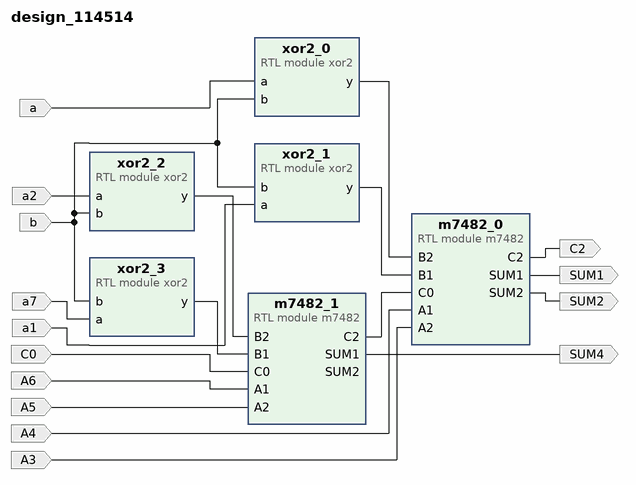
[diagram p0: block diagram of the top level]
# Vivado block design design_114514, xc7z020clg400-1, Vivado 2024.2
create_bd_design design_114514

create_bd_port -dir I A3
create_bd_port -dir I A4
create_bd_port -dir I A5
create_bd_port -dir I A6
create_bd_port -dir I C0
create_bd_port -dir O C2
create_bd_port -dir O SUM1
create_bd_port -dir O SUM2
create_bd_port -dir O SUM4
create_bd_port -dir I a
create_bd_port -dir I a1
create_bd_port -dir I a2
create_bd_port -dir I a7
create_bd_port -dir I b

create_bd_cell -type module -reference m7482 m7482_0
create_bd_cell -type module -reference m7482 m7482_1
create_bd_cell -type module -reference xor2 xor2_0
create_bd_cell -type module -reference xor2 xor2_1
create_bd_cell -type module -reference xor2 xor2_2
create_bd_cell -type module -reference xor2 xor2_3

# ---- connections ----

connect_bd_net -net C0_1 [get_bd_ports C0] [get_bd_pins m7482_1/C0]
connect_bd_net -net adpt_in_0_A0 [get_bd_ports A6] [get_bd_pins m7482_1/A1]
connect_bd_net -net adpt_in_0_A1 [get_bd_ports A5] [get_bd_pins m7482_1/A2]
connect_bd_net -net adpt_in_0_A2 [get_bd_ports A4] [get_bd_pins m7482_0/A1]
connect_bd_net -net adpt_in_0_A3 [get_bd_ports A3] [get_bd_pins m7482_0/A2]
connect_bd_net -net adpt_in_0_B0 [get_bd_ports a7] [get_bd_pins xor2_3/a]
connect_bd_net -net adpt_in_0_B1 [get_bd_ports a2] [get_bd_pins xor2_2/a]
connect_bd_net -net adpt_in_0_B2 [get_bd_ports a1] [get_bd_pins xor2_1/a]
connect_bd_net -net adpt_in_0_B3 [get_bd_ports a] [get_bd_pins xor2_0/a]
connect_bd_net [get_bd_ports b] [get_bd_pins xor2_2/b] [get_bd_pins xor2_1/b] [get_bd_pins xor2_3/b] [get_bd_pins xor2_0/b]
connect_bd_net [get_bd_pins m7482_0/C2] [get_bd_ports C2]
connect_bd_net [get_bd_pins m7482_0/SUM1] [get_bd_ports SUM1]
connect_bd_net [get_bd_pins m7482_0/SUM2] [get_bd_ports SUM2]
connect_bd_net [get_bd_pins m7482_1/C2] [get_bd_pins m7482_0/C0]
connect_bd_net [get_bd_pins m7482_1/SUM1] [get_bd_ports SUM4]
# net m7482_1_SUM2 has one end: m7482_1/SUM2
connect_bd_net [get_bd_pins xor2_0/y] [get_bd_pins m7482_0/B2]
connect_bd_net [get_bd_pins xor2_1/y] [get_bd_pins m7482_0/B1]
connect_bd_net [get_bd_pins xor2_2/y] [get_bd_pins m7482_1/B2]
connect_bd_net [get_bd_pins xor2_3/y] [get_bd_pins m7482_1/B1]

validate_bd_design
save_bd_design
